# EAGLE design v1 (EAGLE 9.4.2)
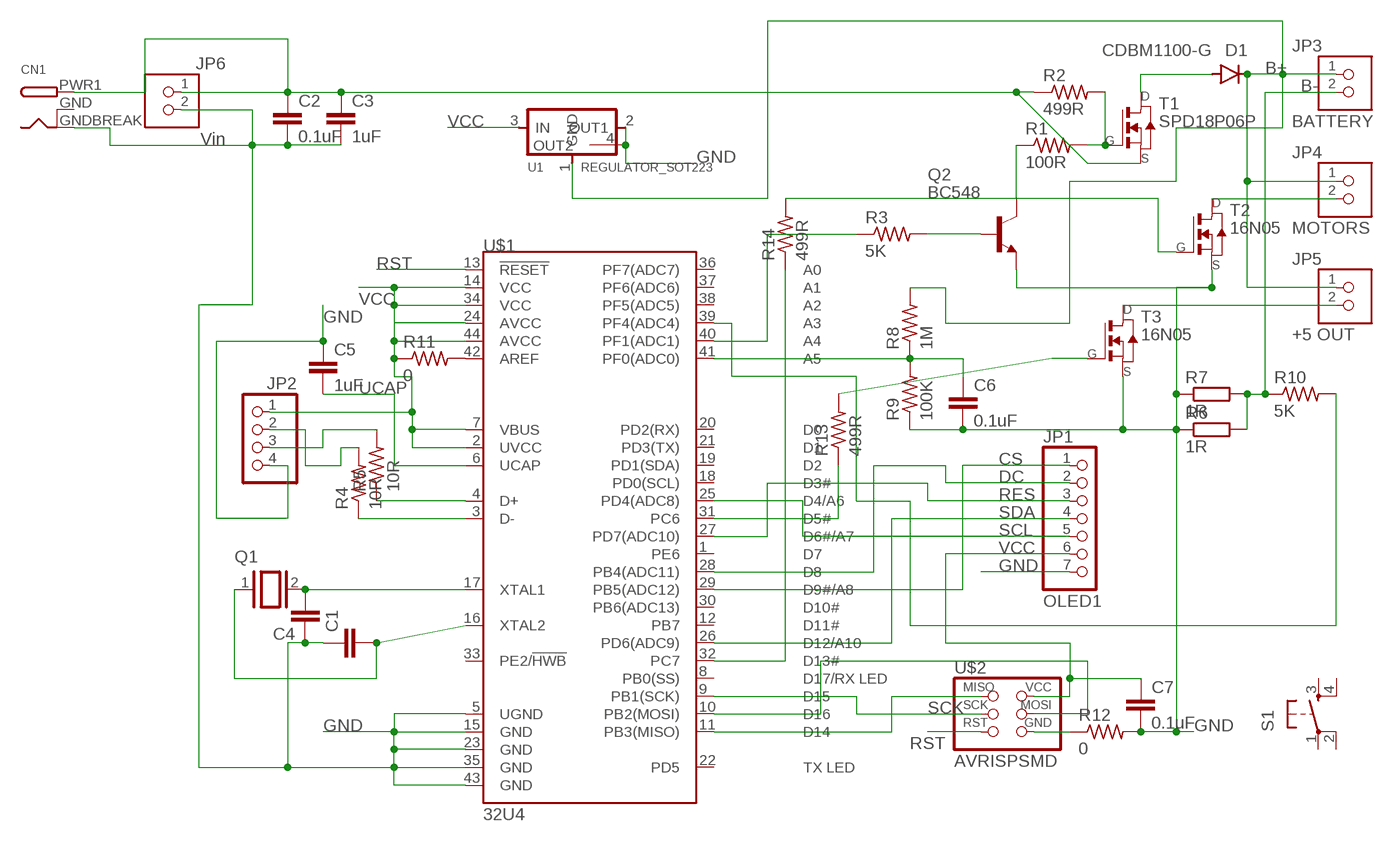
[diagram p0: schematic, sheet 1]

## Parts
C1  C-EUC1206  [C1206]
C2  0.1uF  C-EUC1206  [C1206]
C3  1uF  C-EUC1206  [C1206]
C4  C-EUC1206  [C1206]
C5  1uF  C-EUC1206  [C1206]
C6  0.1uF  C-EUC1206  [C1206]
C7  0.1uF  C-EUC1206  [C1206]
CN1  DCBARRELSMT  [DCJACK_2MM_SMT]
D1  CDBM1100-G  [MINI-SMA]
JP1  OLED1  PINHD-1X7  [1X07]
JP2  PINHD-1X4  [1X04]
JP3  BATTERY  TERM-1X02-FABLAB  [ED555DS-2DS]
JP4  MOTORS  TERM-1X02-FABLAB  [ED555DS-2DS]
JP5  +5 OUT  TERM-1X02-FABLAB  [ED555DS-2DS]
JP6  Vin  TERM-1X02-FABLAB  [ED555DS-2DS]
Q1  XTAL/S  [QS]
Q2  BC548  [TO92-EBC]
R1  100R  R-US_M1206  [M1206]
R2  499R  R-US_M1206  [M1206]
R3  5K  R-US_M1206  [M1206]
R4  10R  R-US_M1206  [M1206]
R5  10R  R-US_M1206  [M1206]
R6  1R  R-EU_R6332W  [R6332W]
R7  1R  R-EU_R6332W  [R6332W]
R8  1M  R-US_M1206  [M1206]
R9  100K  R-US_M1206  [M1206]
R10  5K  R-US_M1206  [M1206]
R11  0  R-US_M1206  [M1206]
R12  0  R-US_M1206  [M1206]
R13  499R  R-US_M1206  [M1206]
R14  499R  R-US_M1206  [M1206]
S1  6MM_SWITCH6MM_SWITCH  [6MM_SWITCH]
T1  SPD18P06P  NMOSFETTO252  [TO252]
T2  16N05  NMOSFETTO252  [TO252]
T3  16N05  NMOSFETTO252  [TO252]
U1  REGULATOR_SOT223  [SOT223]
U$1  32U4  ATMEGA32U4TQFP-44  [TQFP44]
U$2  AVRISPSMD  [2X03SMD]

## Nets
B+: D1.KATHODE JP3.1 JP4.1 JP5.1 R8.2 U1.1(GND)
B-: JP3.2 R6.2 R7.2 R10.1
CS: JP1.1 U$1.29(PB5(ADC12))
DC: JP1.2 U$1.28(PB4(ADC11))
GND: C1.1 C2.2 C3.2 C4.1 C5.1 C6.2 C7.2 CN1.GNDBREAK(GND) JP1.7 JP2.4 JP6.2 Q2.E R6.1 R7.1 R9.1 R12.2 T2.2(S) T3.2(S) U1.2(OUT1) U1.4(OUT2) U$1.5(UGND) U$1.15(GND) U$1.23(GND) U$1.35(GND) U$1.43(GND)
MISO: U$1.11(PB3(MISO)) U$2.1(MISO)
MOSI: U$1.10(PB2(MOSI)) U$2.4(MOSI)
N$1: C4.2 Q1.2 U$1.17(XTAL1)
N$2: R11.2 U$1.42(AREF)
N$3: R3.1 U$1.40(PF1(ADC1))
N$4: R12.1 U$2.6(GND)
N$5: C1.2 Q1.1 U$1.16(XTAL2)
N$6: JP5.2 T3.3(D)
N$7: JP4.2 T2.3(D)
N$8: R14.1 U$1.32(PC7)
N$9: D1.ANODE T1.3(D)
N$10: R1.2 R2.2 T1.1(G)
N$11: Q2.C R1.1
N$12: Q2.B R3.2
N$13: R13.1 U$1.31(PC6)
N$14: C6.1 R8.1 R9.2 U$1.41(PF0(ADC0))
N$15: R10.2 U$1.39(PF4(ADC4))
N$16: JP2.3 R5.2
N$17: R5.1 U$1.4(D+)
N$18: R4.1 U$1.3(D-)
N$19: JP2.2 R4.2
N$20: R14.2 T2.1(G)
N$22: R13.2 T3.1(G)
RES: JP1.3 U$1.27(PD7(ADC10))
RST: U$1.13(!RESET) U$2.5(RST)
SCK: U$1.9(PB1(SCK)) U$2.3(SCK)
SCL: JP1.5 U$1.25(PD4(ADC8))
SDA: JP1.4 U$1.26(PD6(ADC9))
UCAP: C5.2 U$1.6(UCAP)
VCC: C7.1 JP1.6 JP2.1 R11.1 U1.3(IN) U$1.2(UVCC) U$1.7(VBUS) U$1.14(VCC) U$1.24(AVCC) U$1.34(VCC) U$1.44(AVCC) U$2.2(VCC)
VIN: C2.1 C3.1 CN1.PWR1(PWR) JP6.1 R2.1 T1.2(S)
Unconnected: S1.1(P) S1.2(P1) S1.3(S) S1.4(S1) U$1.1(PE6) U$1.8(PB0(SS)) U$1.12(PB7) U$1.18(PD0(SCL)) U$1.19(PD1(SDA)) U$1.20(PD2(RX)) U$1.21(PD3(TX)) U$1.22(PD5) U$1.30(PB6(ADC13)) U$1.33(PE2/!HWB) U$1.36(PF7(ADC7)) U$1.37(PF6(ADC6)) U$1.38(PF5(ADC5))

## Power pins joined to a net without a drawn wire
GNDBREAK: CN1.GND(GNDBREAK)

## Library data of the parts
C1-C7 = rcl:C-EU: CAPACITOR, European symbol; SPICEPREFIX: C
CN1 = adafruit:DCBARREL: 2.0mm DC Barrel Jack DCJACK_2MM_PTH - Through Hole Jack (4UConnector: 05537)
D1 = fab:CDBM1100-G: Diode schottky 100V 1A mini-SMA as found in the fablab inventory Reverse Voltage: 100 Volts Forward Current: 1.0 Amp Maximum forward voltage: 0.85 Volts Made by Zaerc.
JP1 = pinhead:PINHD-1X7: PIN HEADER
JP2 = pinhead:PINHD-1X4: PIN HEADER
JP3-JP6 = fab:TERM-1X02: 3.5mm terminal block, 2 positions ED555-2DS as found in the fablab inventory. Stolen from Adafruit <http://www.ladyada.net/library/pcb/eaglelibrary.html>, adapted by Zaerc.
Q1 = special:XTAL/S: CRYSTAL
Q2 = transistor-npn:BC548*: NPN Transistor
R1-R5 R8-R14 = rcl:R-US_: RESISTOR, American symbol; SPICEPREFIX: R
R6 R7 = rcl:R-EU_: RESISTOR, European symbol; SPICEPREFIX: R
S1 = fab:6MM_SWITCH: OMRON SWITCH
T1-T3 = fab:NMOSFET: MOS FET
U1 = fab:REGULATOR_SOT223
U$1 = SparkFun-IC-Microcontroller:ATMEGA32U4: Atmel MCU, 32KByte Atmel 44-pin 8-bit Microcontroller with 32KBytes of ISP Flash and USB Controller Datasheet <http://cdn.sparkfun.com/datasheets/Dev/Arduino/Boards/ATMega32U4.pdf> SparkFun Products LilyPad Arduino USB - ATmega32U4 Board <https://www.sparkfun.com/products/12049> (DEV-12049) Pro Micro - 5V/16MHz <https://www.sparkfun.com/products/12640> (DEV-12640) Pro Micro - 3.3V/8MHz <https://www.sparkfun.com/products/12587> (DEV-12587) Fio v3 - ATmega32U4 <https://www.sparkfun.com/products/11520> (DEV-11520) Qduino Mini <https://www.sparkfun.com/products/13614> (DEV-13614) Makey Makey - Standard Kit <https://www.sparkfun.com/products/11511> (WIG-11511) Makey Makey Deluxe Kit <https://www.sparkfun.com/products/11519> (WIG-11519); PROD_ID: IC-11161
U$2 = fab:AVRISP

## Board
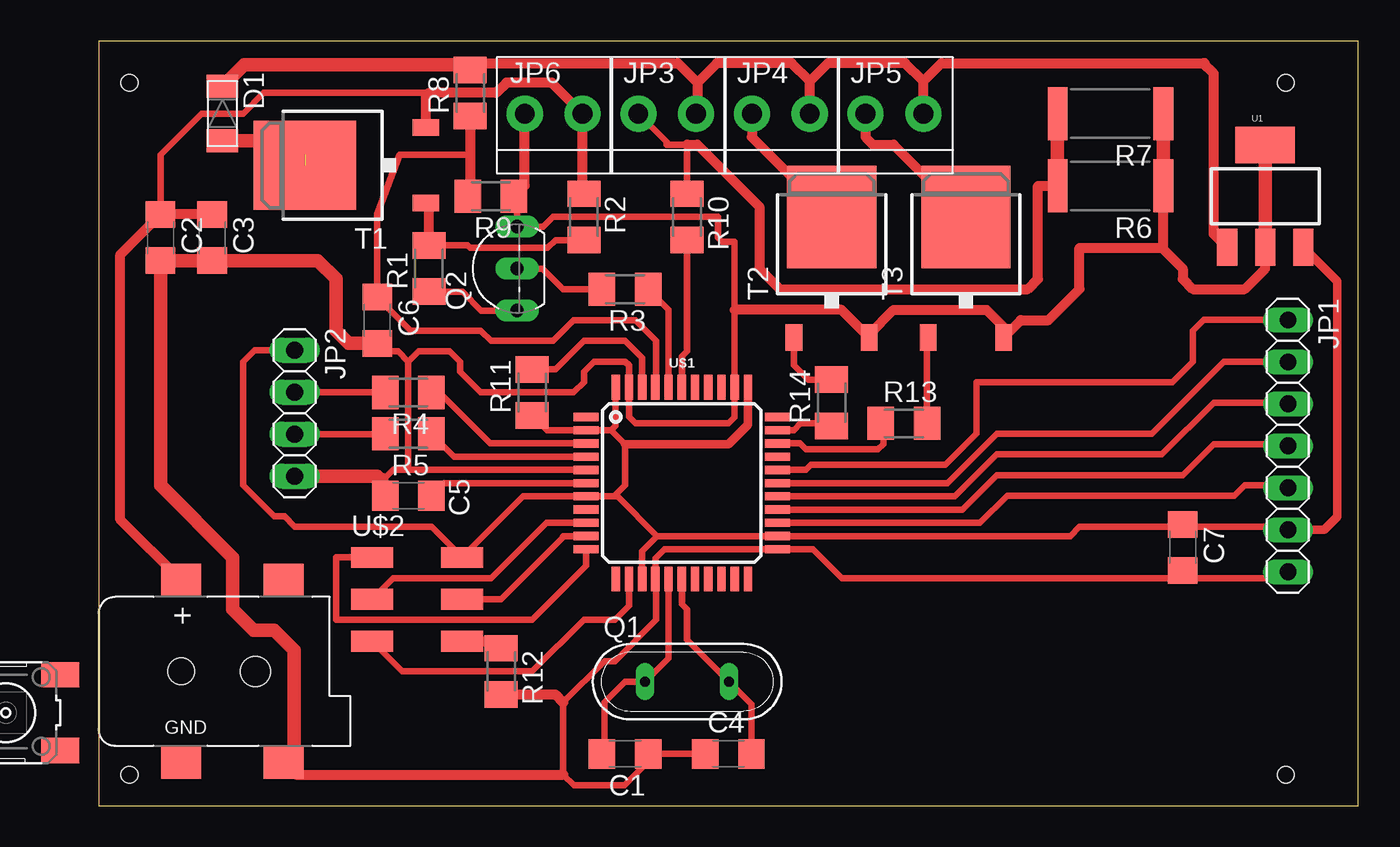
[diagram p1: board, top side]

Size 76.25 x 46.25 mm. Coordinates in mm from the lower left corner, seen from the top.
Outline: 0,0 76.25,0 76.25,46.25 0,46.25 0,0
Copper layers (1*16): Top 0.035mm / dielectric 1.5mm / Bottom 0.035mm
Design rules "default": minimum track width 6mil, minimum drill 0.35mm, track to track 6mil, track to pad 6mil, pad to pad 6mil, via to via 6mil, smd to smd 6mil, copper to edge 40mil, drill to drill 6mil, minimum pad ring 10mil, minimum via ring 8mil, stop-mask expansion 4mil, vias tented up to drill 0mil, thermal gap 10mil
Holes 1 mm at 71.88,43.75 71.88,1.88 1.88,1.88 1.88,43.75

### Footprints (pad centres in the part's own frame; a part is rotated, then mirrored left to right if it is on the bottom)
C1206 = smd 1.6 x 1.8: 1 -1.4,0; 2 1.4,0
DCJACK_2MM_SMT = smd 2.4 x 2: GND 0,-5.5; GNDBREAK 6.2,-5.5; PWR1 0,5.5; PWR2 6.2,5.5 | hole 1.6: 0,0 | hole 1.8: 4.5,0
MINI-SMA = smd 1.4 x 1.9: ANODE 1.65,0; KATHODE -1.65,0
1X07 = drill 1.016 long: 1 -7.62,0; 2 -5.08,0; 3 -2.54,0; 4 0,0; 5 2.54,0; 6 5.08,0; 7 7.62,0
1X04 = drill 1.016 long: 1 -3.81,0; 2 -1.27,0; 3 1.27,0; 4 3.81,0
ED555DS-2DS = drill 1.2 pad 2.184: 1 1.8,0; 2 -1.7,0
QS = drill 0.61 long: 1 -2.54,0; 2 2.54,0
TO92-EBC = drill 0.813 long: B 0,-1.27; C -2.54,-1.27; E 2.54,-1.27
M1206 = smd 1.6 x 2: 1 -1.4,0; 2 1.4,0
R6332W = smd 1.2 x 3.2: 1 -3.196,0; 2 3.196,0
6MM_SWITCH = smd 2.286 x 1.524: 1 -3.302,2.286; 2 3.302,2.286; 3 -3.302,-2.286; 4 3.302,-2.286
TO252 = smd 1 x 1.6: 1 -2.28,-4.8; 2 2.28,-4.8 | smd 5.4 x 6.2: 3 0,2.5
SOT223 = smd 1.219 x 2.235: 1 -2.311,-3.099; 2 0,-3.099; 3 2.311,-3.099 | smd 3.6 x 2.2: 4 0,3.099
TQFP44 = smd 1.5 x 0.5: 1 -5.8,4; 2 -5.8,3.2; 3 -5.8,2.4; 4 -5.8,1.6; 5 -5.8,0.8; 6 -5.8,0; 7 -5.8,-0.8; 8 -5.8,-1.6; 9 -5.8,-2.4; 10 -5.8,-3.2; 11 -5.8,-4; 23 5.8,-4; 24 5.8,-3.2; 25 5.8,-2.4; 26 5.8,-1.6; 27 5.8,-0.8; 28 5.8,0; 29 5.8,0.8; 30 5.8,1.6; 31 5.8,2.4; 32 5.8,3.2; 33 5.8,4 | smd 0.5 x 1.5: 12 -4,-5.8; 13 -3.2,-5.8; 14 -2.4,-5.8; 15 -1.6,-5.8; 16 -0.8,-5.8; 17 0,-5.8; 18 0.8,-5.8; 19 1.6,-5.8; 20 2.4,-5.8; 21 3.2,-5.8; 22 4,-5.8; 34 4,5.8; 35 3.2,5.8; 36 2.4,5.8; 37 1.6,5.8; 38 0.8,5.8; 39 0,5.8; 40 -0.8,5.8; 41 -1.6,5.8; 42 -2.4,5.8; 43 -3.2,5.8; 44 -4,5.8
2X03SMD = smd 2.54 x 1.27: 1 -2.54,2.54; 2 2.92,2.54; 3 -2.54,0; 4 2.92,0; 5 -2.54,-2.54; 6 2.92,-2.54

### Placement (x,y rotation side)
C1  31.88,3.12 180 top
C2  3.75,34.38 270 top
C3  6.88,34.38 270 top
C4  38.12,3.12 0 top
C5  18.75,18.75 0 top
C6  16.88,29.38 270 top
C7  65.62,15.62 270 top
CN1  5,8.12 0 top
D1  7.5,41.88 270 top
JP1  72,21.77 270 top
JP2  11.88,23.75 270 top
JP3  34.38,41.88 0 top
JP4  41.25,41.88 0 top
JP5  48.12,41.88 0 top
JP6  27.5,41.88 0 top
Q1  35.62,7.5 0 top
Q2  24.06,32.5 90 top
R1  20,32.5 90 top
R2  29.38,35.62 270 top
R3  31.88,31.25 180 top
R4  18.75,25 180 top
R5  18.75,22.5 180 top
R6  61.25,37.5 180 top
R7  61.25,41.88 180 top
R8  22.5,43.12 90 top
R9  23.75,36.88 180 top
R10  35.62,35.62 270 top
R11  26.25,25 90 top
R12  24.38,8.12 270 top
R13  48.75,23.12 0 top
R14  44.38,24.38 90 top
S1  -5.62,5.62 0 top
T1  15,38.75 90 top
T2  44.38,33.12 0 top
T3  52.5,33.12 0 top
U1  70.62,36.88 0 top
U$1  35.3,19.52 0 top
U$2  19.09,12.47 0 top

### Tracks (layer width: path | path; a pad name or v marks a point on that pad's centre or on a via)
B+
  Top 0.508: U1.1 68.31,33.94
  Top 0.61: R8.2 22.9,44.93 35.07,44.93 36.25,43.75 | 36.25,43.75 36.25,41.95 JP3.1 | JP4.1 43.05,43.83 | 43.05,43.83 41.95,44.93 37.43,44.93 36.25,43.75 | JP5.1 49.92,43.83 | 49.92,43.83 48.82,44.93 44.15,44.93 43.05,43.83 | 49.92,43.83 51.03,44.93 66.88,44.93 | 66.88,44.93 66.94,44.93 | U1.1 67.5,34.59 67.5,44.3 66.88,44.93
  Top 0.813: R8.2 22.2,44.83 8.8,44.83 D1.KATHODE
B-
  Top 0.406: 58.05,40 R7.2 | JP3.2 34.38,40.17 34.38,40 35.62,40 R10.1
  Top 0.61: 35.62,40 36.25,40 40,36.25 40,32.5 41.25,31.25 56.25,31.25 56.88,31.88 56.88,37.5 R6.2
  Top 0.813: R7.2 R6.2
CS
  Top 0.406: U$1.29 42.81,20.32 43.12,20.62 51.25,20.62 53.12,22.5 53.12,25.62 65,25.62 66.25,26.88 66.25,28.75 66.89,29.39 JP1.1
DC
  Top 0.406: JP1.2 68.1,26.85 63.75,22.5 54.38,22.5 51.39,19.52 U$1.28
GND
  Top 0.406: C4.1 C1.1 33.27,2.65 31.84,1.22 28.78,1.22 28.12,1.88 28.12,6.25 30.62,8.75 31.25,8.75 33.75,11.25 33.75,13.67 U$1.15 33.7,14.96 34.27,15.52 U$1.23 43.23,15.52 45,13.75 65.62,13.75 | U$1.5 18.75,20.32 | 18.75,20.32 17.82,20.32 17.35,19.85 | 17.35,19.85 C5.1 | 18.75,26.88 19.38,27.5 21.25,27.5 21.88,26.88 21.88,26.25 23.12,25 28.75,25 29.38,25.62 29.38,26.25 30,26.88 31.88,26.88 32.1,26.64 U$1.43 32.1,23.52 32.5,23.12 38.12,23.12 38.51,23.5 U$1.35 38.51,30 38.51,34.13 37.74,34.13 37.5,34.38 37.5,35.62 27.5,35.62 26.91,35.04 Q2.E 25.33,36.69 R9.1 | 18.75,20.32 18.75,26.88 | 65.62,13.75 71.6,13.75 JP1.7 | C6.2 17.35,27.5 18.12,27.5 18.75,26.88 | C7.2 65.62,13.75 | 16.88,19.94 17.26,19.94 17.35,19.85
  Top 0.61: R9.1 25.8,37.52 JP6.2 | CN1.GNDBREAK 11.95,1.88 28.12,1.88 | 64.38,33.75 59.38,33.75 59.38,31.25 57.5,29.38 55.83,29.38 T3.2 54.78,28.97 53.75,30 48.12,30 46.66,28.53 T2.2 44.98,30 38.51,30 | 64.38,33.75 64.45,33.82 R6.1 | 64.47,39.97 64.45,40 | 64.38,33.75 65.62,32.5 65.62,31.88 66.25,31.25 69.38,31.25 70.62,32.5 U1.2 | R12.2 27.65,6.72 28.12,6.25
  Top 0.813: R7.1 64.45,40 R6.1 | C6.2 15.15,27.98 14.38,28.75 14.38,31.88 13.28,32.98 C3.2 C2.2 3.75,19.38 8.12,15 8.12,11.88 9.38,10.62 10.62,10.62 11.85,9.4 11.85,3.51 11.2,2.86 CN1.GNDBREAK | U1.2 U1.4 | JP2.4 16.88,19.94
MISO
  Top 0.406: U$2.1 14.38,15.02 14.38,11.25 26.25,11.25 29.5,14.51 U$1.11
MOSI
  Top 0.406: U$2.4 22.04,12.5 24.38,12.5 28.12,16.25 28.12,16.32 U$1.10
N$1
  Top 0.406: U$1.17 35.3,12.2 35.62,11.88 35.62,10.04 Q1.2 39.52,6.14 C4.2
N$2
  Top 0.406: R11.2 27.65,26.4 29.38,28.12 31.88,28.12 32.91,27.09 U$1.42
N$3
  Top 0.406: U$1.40 34.51,30.02 R3.1
N$4
  Top 0.61: U$2.6 23.96,9.94 R12.1
N$5
  Top 0.406: U$1.16 34.51,8.92 Q1.1 31.88,7.5 30.62,6.25 30.62,3.27 C1.2
N$6
  Top 0.61: JP5.2 46.42,40.45 46.88,40 48.12,40 T3.3
N$7
  Top 0.61: JP4.2 39.55,40.45 T2.3
  Top 0.813: JP4.2 39.38,41.88
N$8
  Top 0.406: U$1.32 42.09,22.71 42.5,23.12 44.23,23.12 R14.1
N$9  (1 unrouted)
  Top 0.813: 12.49,39.38 13.33,40.23 D1.ANODE
N$10
  Top 0.406: R1.2 22.35,33.9 22.5,33.75 27.19,33.75 27.66,34.23 R2.2
  Top 0.61: 29.05,33.9 R2.2 | R1.2 20,36.27 T1.1
N$11
  Top 0.406: R1.1 22.02,31.1 23.16,29.96 Q2.C
N$12
  Top 0.406: Q2.B 26.88,32.5 28.12,31.25 R3.2
N$13
  Top 0.406: U$1.31 42.46,21.91 42.81,21.56 47.19,21.56 47.5,21.88 47.5,22.98 R13.1
N$14
  Top 0.406: 22.5,39.38 18.21,39.38 16.88,35.8 C6.1 18.9,28.75 23.12,28.75 23.75,28.12 27.5,28.12 28.75,29.38 32.5,29.38 33.75,28.12 33.75,25.36 U$1.41
  Top 0.61: R8.1 22.5,39.38 22.5,37.02 R9.2
N$15
  Top 0.406: U$1.39 35.3,27.18 35.62,27.5 R10.2
N$16
  Top 0.406: R5.2 17.33,22.48 JP2.3
N$17
  Top 0.406: R5.1 21.54,21.11 U$1.4
N$18
  Top 0.406: R4.1 20.62,25 23.71,21.91 U$1.3
N$19
  Top 0.406: JP2.2 17.33,25.02 R4.2
N$20
  Top 0.406: T2.1 42.09,26.66 42.98,25.77 R14.2
N$22
  Top 0.406: R13.2 50.15,28.25 T3.1
RES
  Top 0.406: U$1.27 51.84,18.71 54.38,21.25 64.38,21.25 67.5,24.38 71.94,24.38 JP1.3
RST
  Top 0.406: U$1.13 32.1,12.11 31.25,11.25 29.38,11.25 26.25,8.12 18.36,8.12 U$2.5
SCK
  Top 0.406: U$2.3 17.82,13.75 23.75,13.75 27.11,17.11 U$1.9
SCL
  Top 0.406: U$1.25 53.37,17.11 55,18.75 68.75,18.75 69.38,19.38 71.86,19.38 JP1.5
SDA
  Top 0.406: U$1.26 52.29,17.91 54.38,20 65.62,20 67.5,21.88 71.89,21.88 JP1.4
UCAP
  Top 0.406: U$1.6 20.91,19.52 C5.2
VCC
  Top 0.406: 31.21,18.71 U$1.7 25.71,18.71 U$2.2 20.15,16.88 11.88,16.88 11.25,17.5 10.62,17.5 8.75,19.38 8.75,26.88 9.44,27.56 JP2.1 | 31.21,18.71 31.88,19.38 31.88,21.88 31.04,22.71 | 31.04,22.71 U$1.2 27.14,22.71 R11.1 | 33.81,16.32 U$1.24 58.81,16.32 59.38,16.88 65.62,16.88 | U$1.14 32.91,15.4 33.81,16.32 | 31.21,18.71 31.41,18.71 33.81,16.32 | U$1.44 31.3,22.98 31.04,22.71 | 65.62,16.88 71.81,16.88 JP1.6 | C7.1 65.62,16.88
  Top 0.508: JP1.6 74.19,16.69 74.98,17.48 74.98,31.73 U1.3 | U$1.34 39.3,23.05 38.12,21.88 31.88,21.88
VIN
  Top 0.406: 20,43.12 10,43.12 8.75,41.88 6.25,41.88 3.75,39.38 C2.1
  Top 0.61: T1.2 19.8,42.92 20,43.12 24.06,43.12 24.69,43.75 27.43,43.75 JP6.1 29.3,37.1 R2.1 | C3.1 C2.1 1.32,33.35 1.32,17.3 CN1.PWR1